# Altium schematic sheet 0141_FRONT PANEL - PWR .SchDoc
size 848 x 558 mm
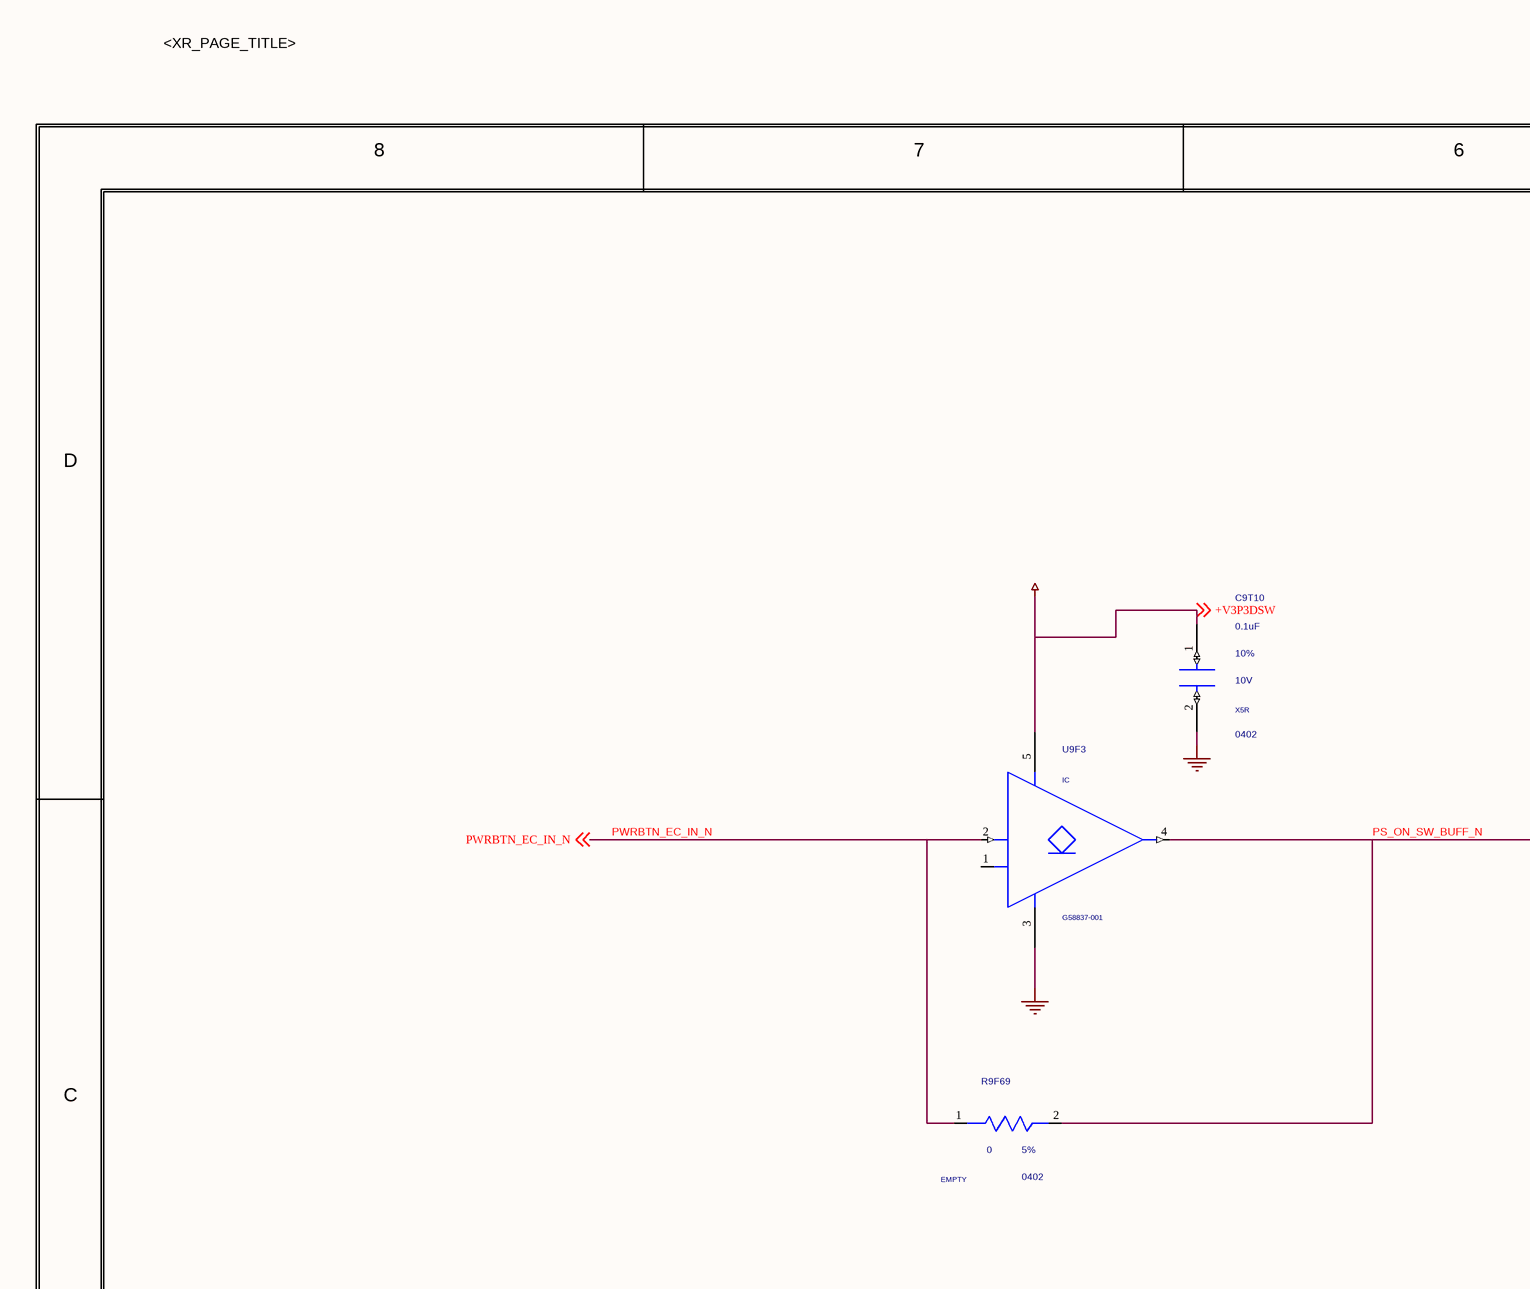
[diagram p0: 0141_FRONT PANEL - PWR .SchDoc, top left]
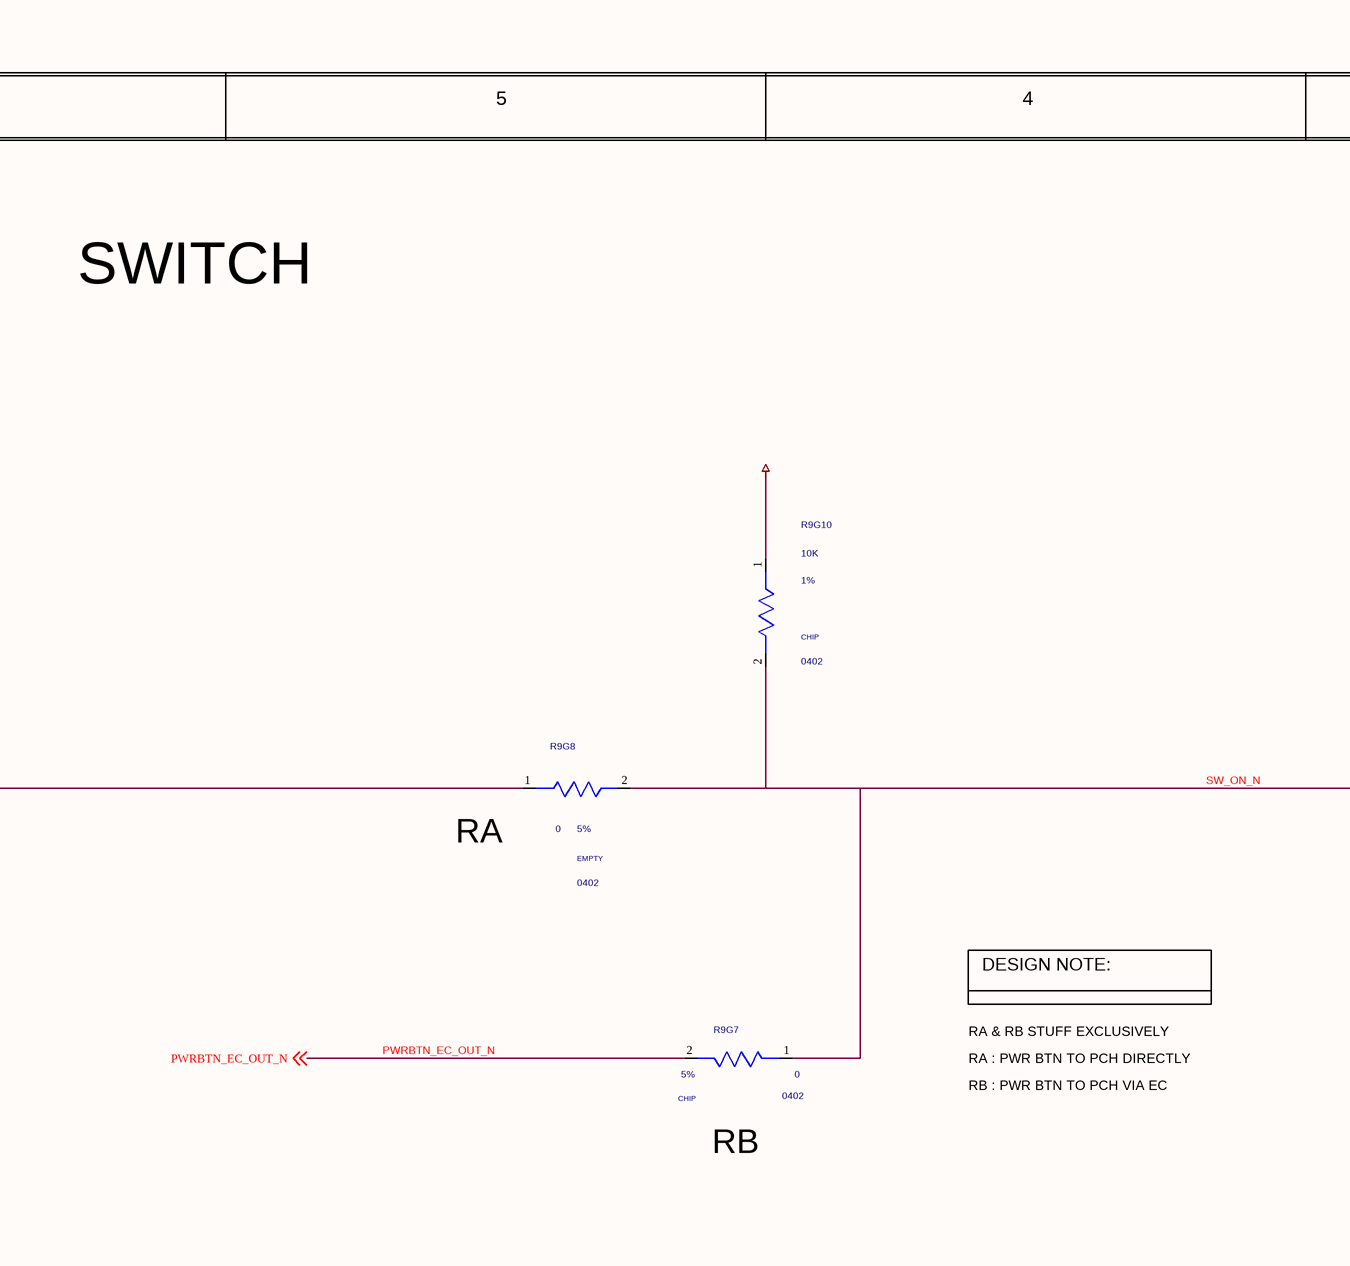
[diagram p1: 0141_FRONT PANEL - PWR .SchDoc, top middle]
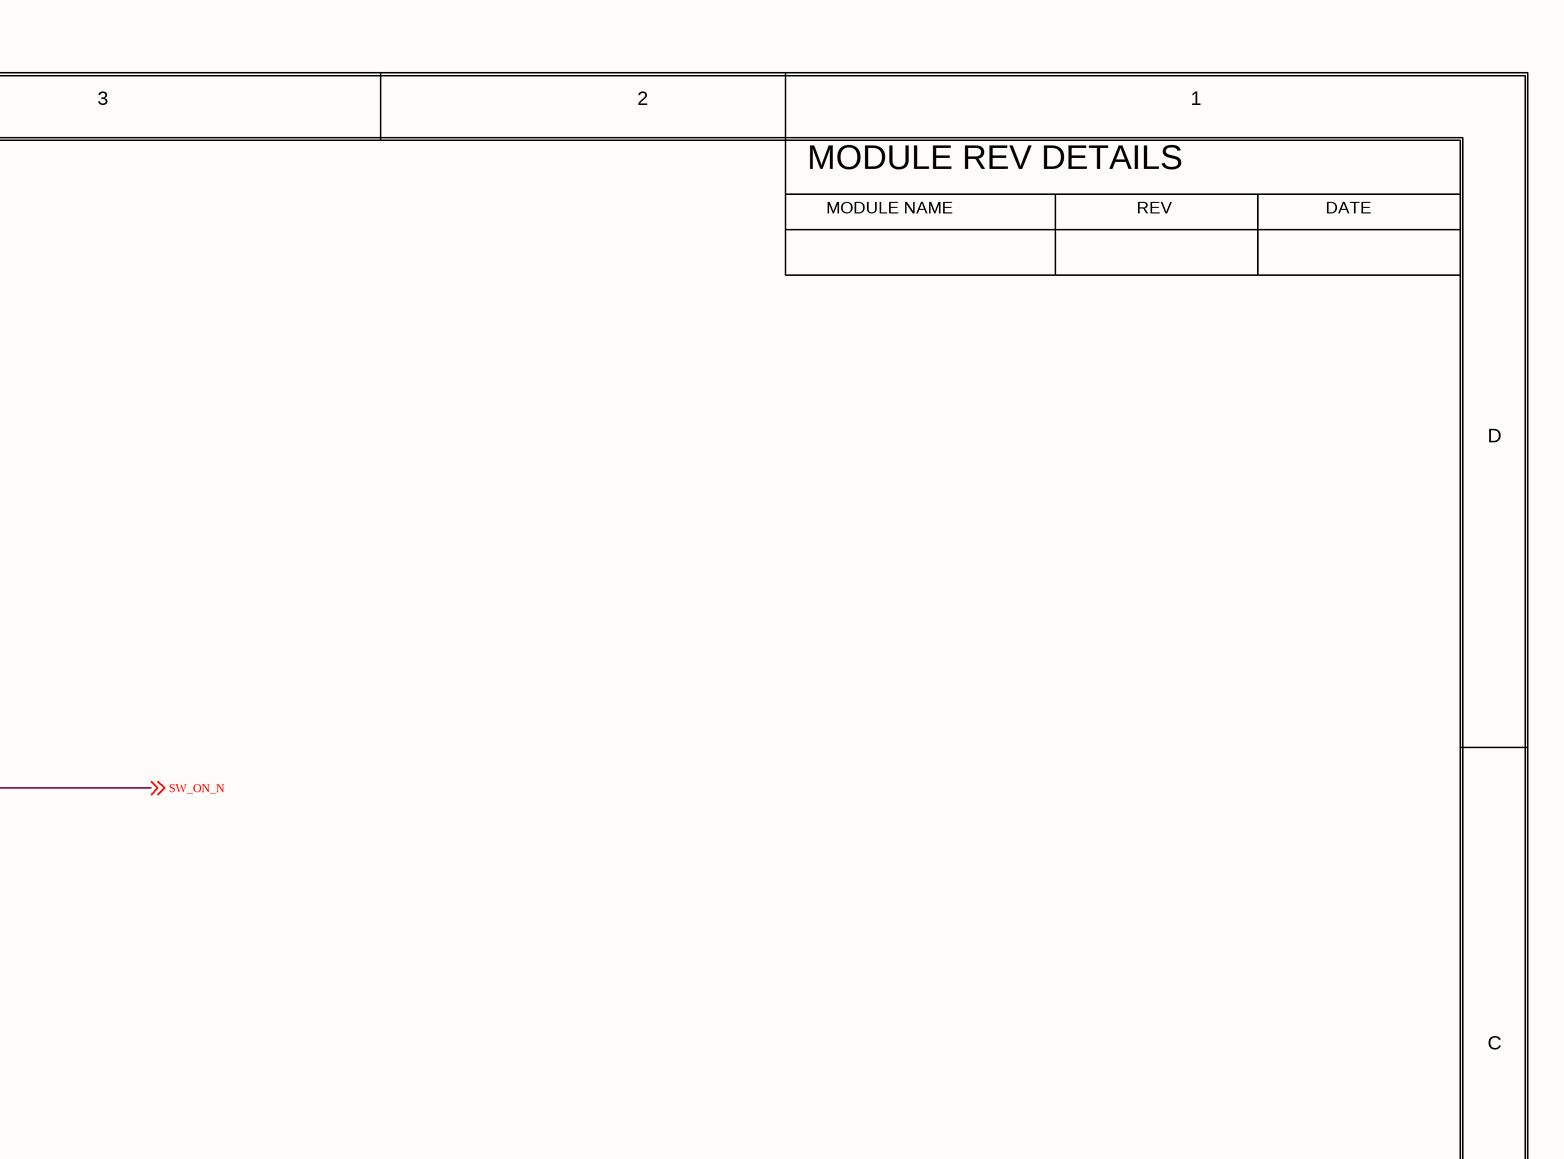
[diagram p2: 0141_FRONT PANEL - PWR .SchDoc, top right]
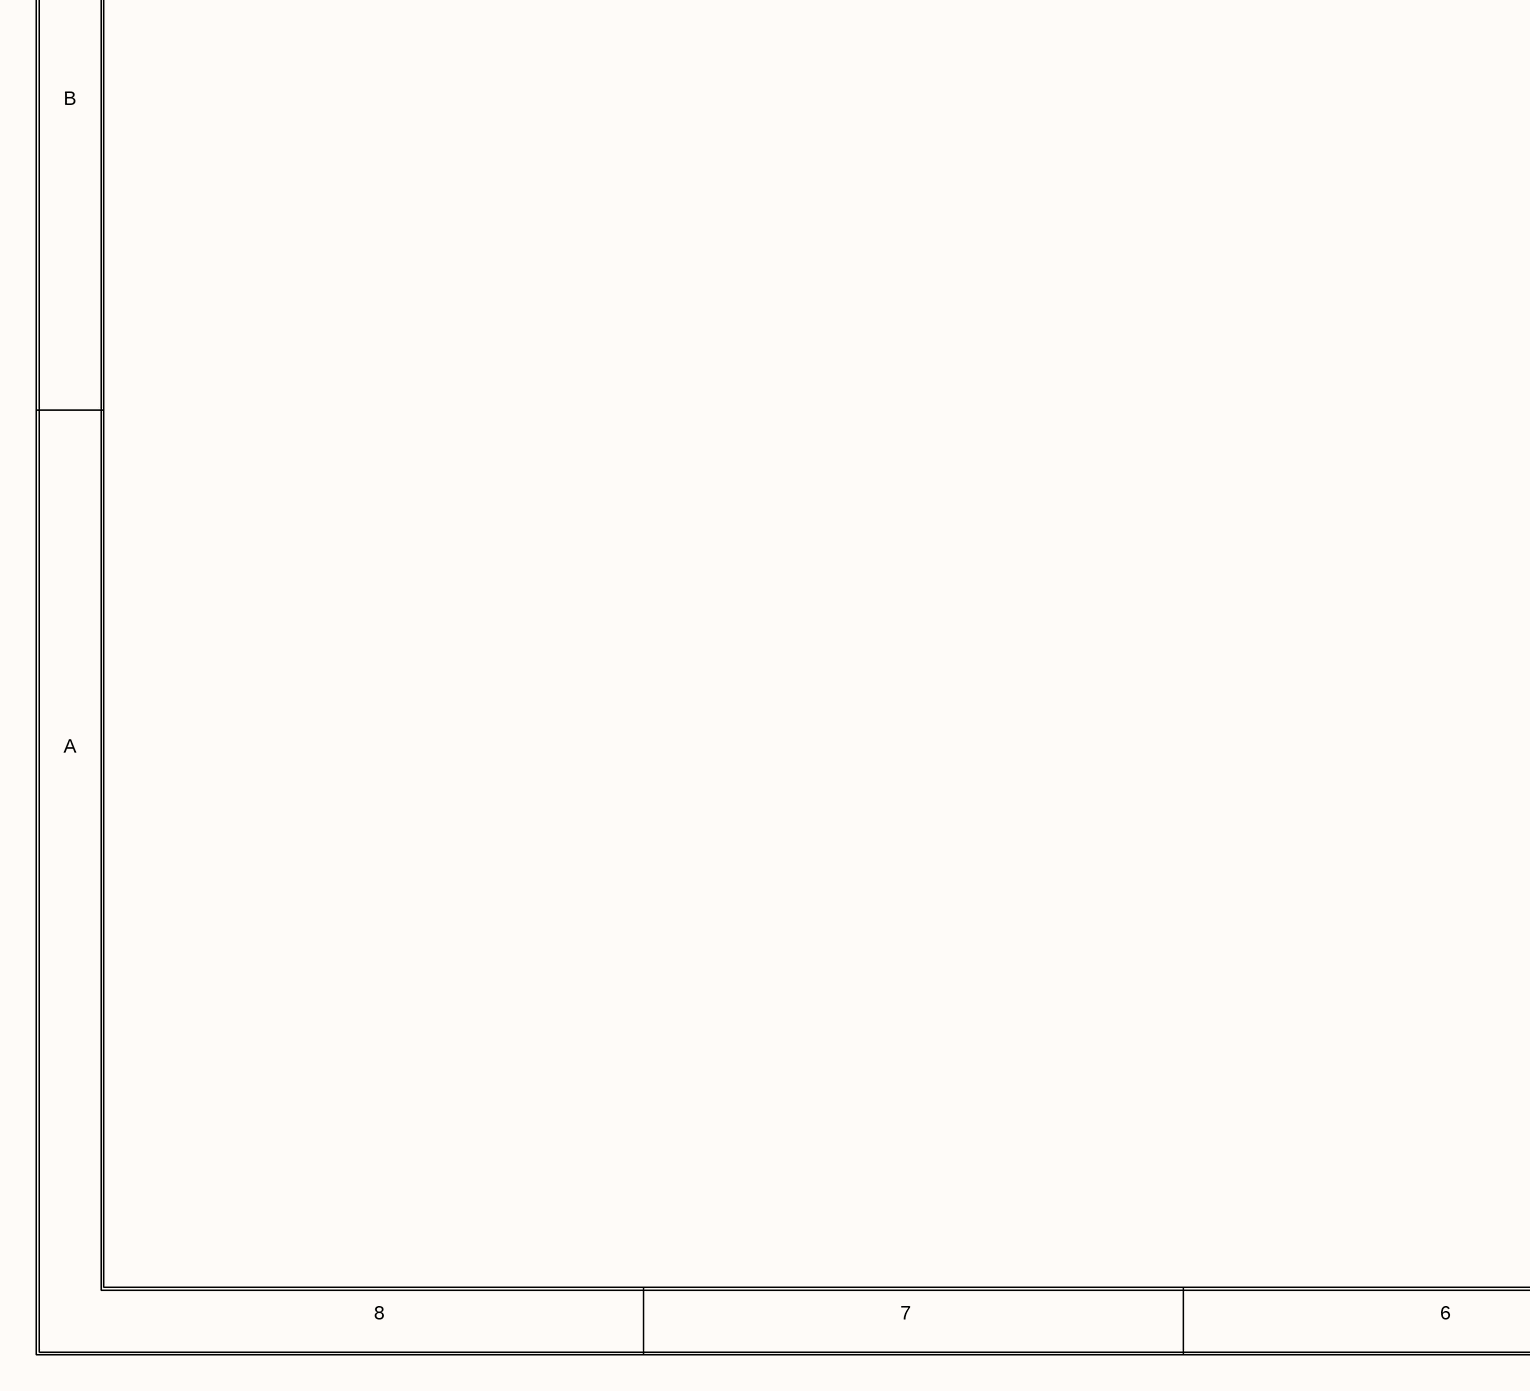
[diagram p3: 0141_FRONT PANEL - PWR .SchDoc, bottom left]
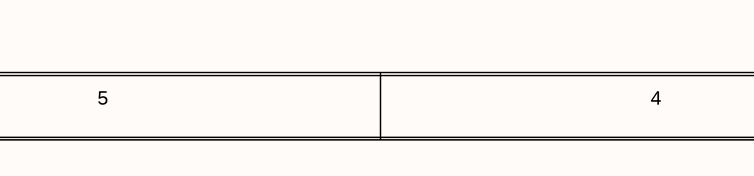
[diagram p4: 0141_FRONT PANEL - PWR .SchDoc, bottom middle]
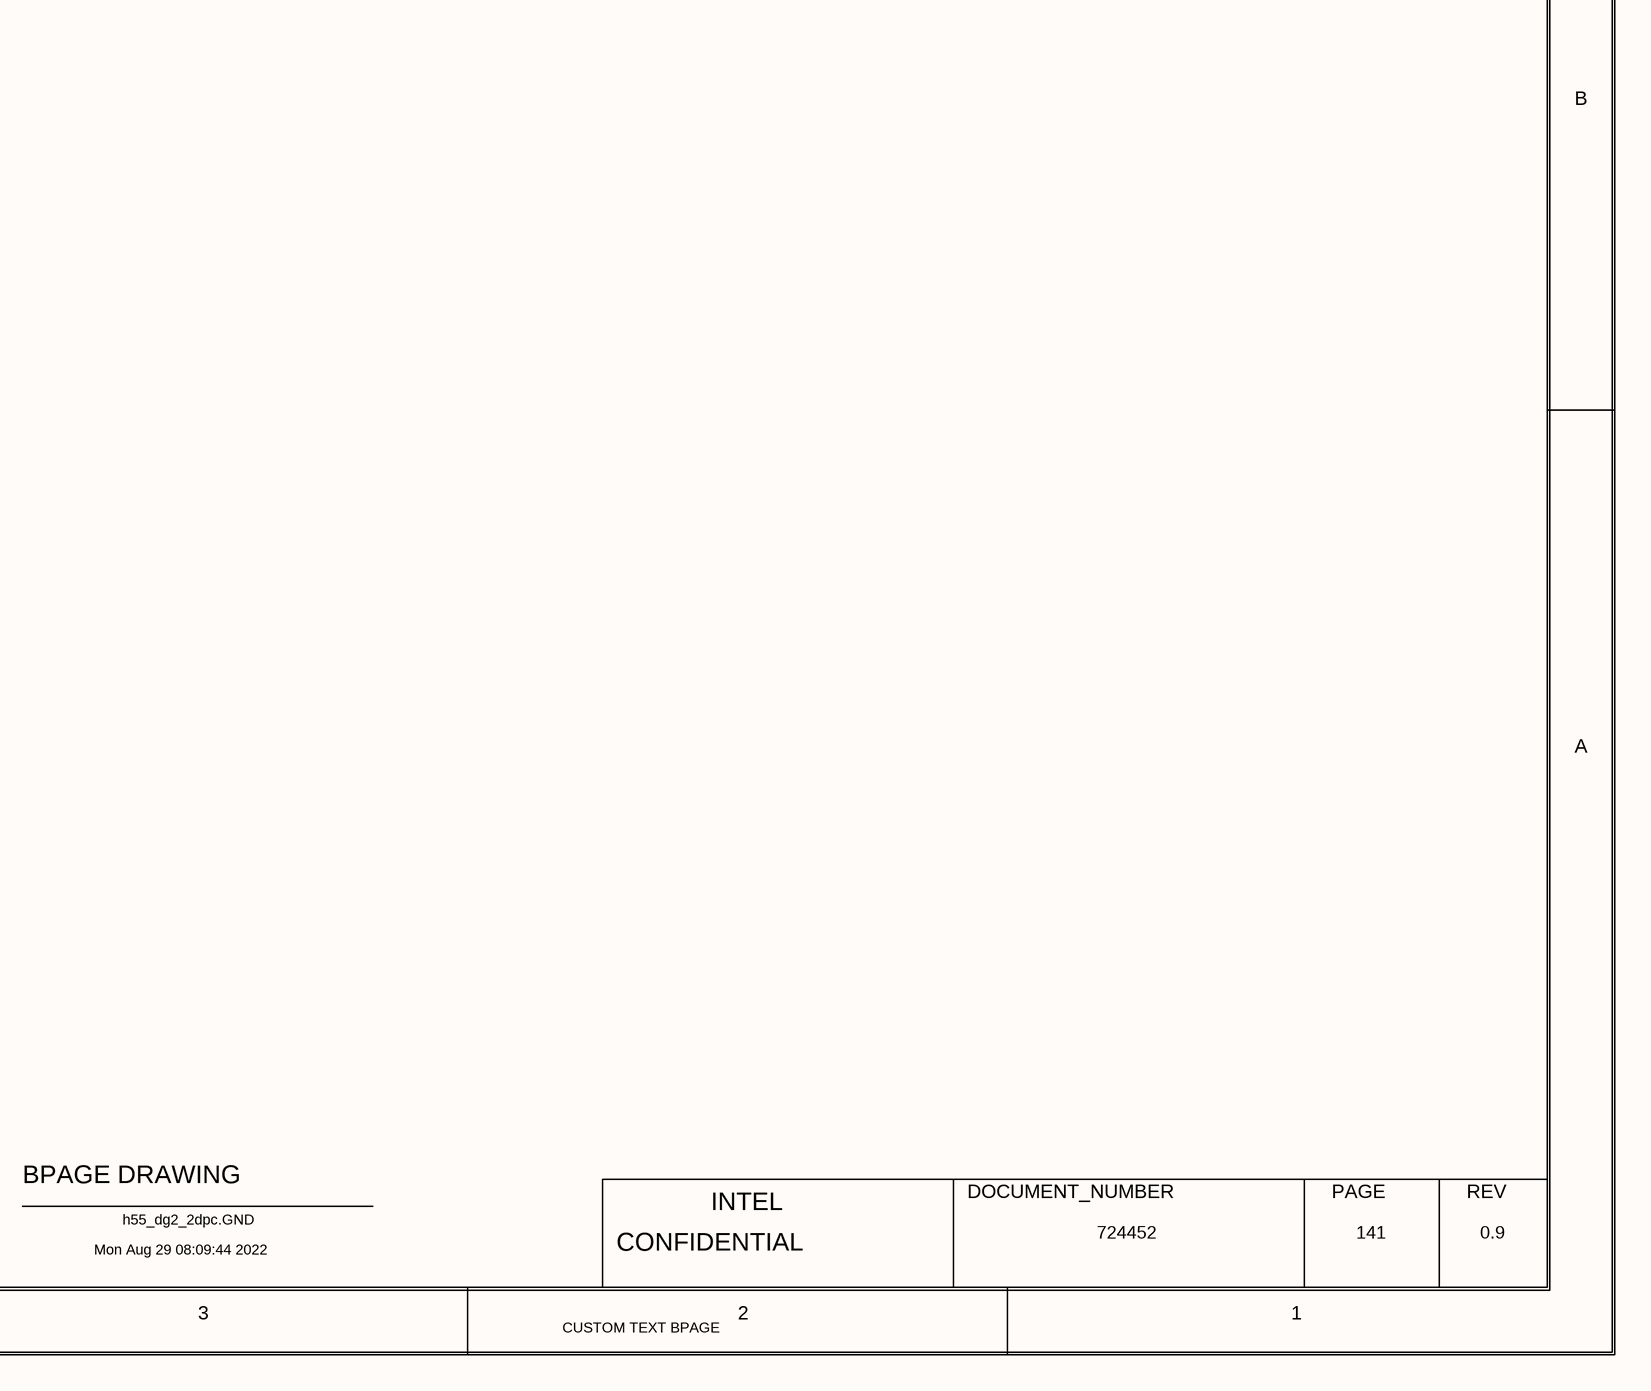
[diagram p5: 0141_FRONT PANEL - PWR .SchDoc, bottom right]

## Parts
C9T10  0.1uF  MATERIAL: X5R  PACK_TYPE: 0402  TOLERANCE: 10%  VOLTAGE: 10V  [SMC0402IA]
R9F69  0  MATERIAL: EMPTY  PACK_TYPE: 0402  TOLERANCE: 5%  [SMR0402IA]
R9G7  0  MATERIAL: CHIP  PACK_TYPE: 0402  TOLERANCE: 5%  [SMR0402IA]
R9G8  0  MATERIAL: EMPTY  PACK_TYPE: 0402  TOLERANCE: 5%  [SMR0402IA]
R9G10  10K  MATERIAL: CHIP  PACK_TYPE: 0402  TOLERANCE: 1%  [SMR0402IA]
U9F3  MATERIAL: IC  PART_NUMBER: G58837-001  [TSSOP5_21X13_65MA]  (hidden comment: TTL07)

## Nets
+V3P3DSW: C9T10.1(A) R9G10.1(A) U9F3.5(VCC) ; off-sheet +V3P3DSW
GND: C9T10.2(B) U9F3.3(GND)
PS_ON_SW_BUFF_N: R9F69.2(B) R9G8.1(A) U9F3.4(Y)
PWRBTN_EC_IN_N: R9F69.1(A) U9F3.2(A) ; off-sheet PWRBTN_EC_IN_N
PWRBTN_EC_OUT_N: R9G7.2(B) ; off-sheet PWRBTN_EC_OUT_N
SW_ON_N: R9G7.1(A) R9G8.2(B) R9G10.2(B) ; off-sheet SW_ON_N

Not connected (* = marked no-connect by the designer): U9F3 1(NC)

## Notes on the sheet
- <XR_PAGE_TITLE>
- 8
- 7
- 6
- 5
- 4
- 3
- 2
- 1
- MODULE REV DETAILS
- MODULE NAME
- REV
- DATE
- SWITCH
- D
- (near R9G8) RA
- DESIGN NOTE:
- C
- RA : PWR BTN TO PCH DIRECTLY
- RA & RB STUFF EXCLUSIVELY
- RB : PWR BTN TO PCH VIA EC
- RB
- B
- A
- BPAGE DRAWING
- INTEL
- DOCUMENT_NUMBER
- PAGE
- Mon Aug 29 08:09:44 2022
- h55_dg2_2dpc.GND
- CONFIDENTIAL
- 724452
- 141
- 0.9
- CUSTOM TEXT BPAGE

## Library data of the parts
C9T10 = CAP: PART_NUMBER: A36096-043; CDS_PHYS_PART_NAME: CAP_0402-A36096-043,X5R,0.1UF,10V,10%,LPDB,GENERIC; OriginalSymbolOrigin: (-50,25); XY: (-5975,4100); VER: 1; ROT: 0; ROOM: ROOM_PROP_TEST_259; PHYS_PAGE: 141; LOCATION: C9T10; IP: GENERIC; FP_TECH: LPDB; DRAWING: @RVP1_ADL_SB_ADP_S_DDR5_SODIMM_2DPC_LIB.H55_DG2_2DPC(SCH_1):PAGE510; CDS_LIB: discrete; PCB Footprint: SMC0402IA; CHIPS_PART_NAME: CAP; CDS_PART_NAME: CAP_0402-A36096-043,X5R,0.1UF,10V,10%,LPDB,GENERIC; CDS_LOCATION: C9T10
R9F69 = RES#1: PART_NUMBER: A93549-001; CHIPS_PART_NAME: RES; CDS_PHYS_PART_NAME: RES_0402-A93549-001,EMPTY,0,5%,1/16W,LPDB,GENERIC; WATTAGE: 1/16W; OriginalSymbolOrigin: (-75,25); XY: (-6325,3275); VER: 1; PHYS_PAGE: 141; LOCATION: R9F69; DRAWING: @RVP1_ADL_SB_ADP_S_DDR5_SODIMM_2DPC_LIB.H55_DG2_2DPC(SCH_1):PAGE510; CDS_LIB: discrete; PCB Footprint: SMR0402IA; ROT: 0; CDS_PART_NAME: RES_0402-A93549-001,EMPTY,0,5%,1/16W,LPDB,GENERIC; CDS_LOCATION: R9F69
R9G7 = RES#1: PART_NUMBER: A93549-001; CHIPS_PART_NAME: RES; CDS_PHYS_PART_NAME: RES_0402-A93549-001,CHIP,0,5%,1/16W,LPDB,GENERIC; WATTAGE: 1/16W; OriginalSymbolOrigin: (-75,25); XY: (-4050,3300); VER: 1; ROT: 2; PHYS_PAGE: 141; LOCATION: R9G7; IP: GENERIC; FP_TECH: LPDB; FIN: EC; DRAWING: @RVP1_ADL_SB_ADP_S_DDR5_SODIMM_2DPC_LIB.H55_DG2_2DPC(SCH_1):PAGE510; CDS_LIB: discrete; PCB Footprint: SMR0402IA; CDS_PART_NAME: RES_0402-A93549-001,CHIP,0,5%,1/16W,LPDB,GENERIC; CDS_LOCATION: R9G7; ASI_MODEL: A93549-001
R9G8 = RES#1: PART_NUMBER: A93549-001; CHIPS_PART_NAME: RES; CDS_PHYS_PART_NAME: RES_0402-A93549-001,EMPTY,0,5%,1/16W,LPDB,GENERIC; WATTAGE: 1/16W; OriginalSymbolOrigin: (-75,25); XY: (-4350,3800); VER: 1; PHYS_PAGE: 141; LOCATION: R9G8; IP: GENERIC; FP_TECH: LPDB; FIN: FP; DRAWING: @RVP1_ADL_SB_ADP_S_DDR5_SODIMM_2DPC_LIB.H55_DG2_2DPC(SCH_1):PAGE510; CDS_LIB: discrete; BOM: FP_HEADER; PCB Footprint: SMR0402IA; ROT: 0; CDS_PART_NAME: RES_0402-A93549-001,EMPTY,0,5%,1/16W,LPDB,GENERIC; CDS_LOCATION: R9G8; ASI_MODEL: A93549-001
R9G10 = RES: PART_NUMBER: A93548-034; CDS_PHYS_PART_NAME: RES_0402-A93548-034,CHIP,10K,1%,1/16W,LPDB,GENERIC; WATTAGE: 1/16W; OriginalSymbolOrigin: (-25,75); XY: (-4000,4125); VER: 2; ROT: 0; PHYS_PAGE: 141; LOCATION: R9G10; IP: GENERIC; FP_TECH: LPDB; DRAWING: @RVP1_ADL_SB_ADP_S_DDR5_SODIMM_2DPC_LIB.H55_DG2_2DPC(SCH_1):PAGE510; CDS_LIB: discrete; PCB Footprint: SMR0402IA; CHIPS_PART_NAME: RES; CDS_PART_NAME: RES_0402-A93548-034,CHIP,10K,1%,1/16W,LPDB,GENERIC; CDS_LOCATION: R9G10
U9F3 = TTL07: CDS_PHYS_PART_NAME: TTL07_SM-G58837-001,IC,74AUP1G07GW,LPDB,GENERIC; CDS_LMAN_SYM_OUTLINE: -100,150,150,-150; PACK_TYPE: SM; OriginalSymbolOrigin: (-125,125); XY: (-6225,3800); VER: 1; ROT: 0; PHYS_PAGE: 141; LOCATION: U9F3; IP: GENERIC; FP_TECH: LPDB; DRAWING: @RVP1_ADL_SB_ADP_S_DDR5_SODIMM_2DPC_LIB.H55_DG2_2DPC(SCH_1):PAGE510; CDS_LIB: ttl; PCB Footprint: TSSOP5_21X13_65MA; CHIPS_PART_NAME: TTL07; CDS_PART_NAME: TTL07_SM-G58837-001,IC,74AUP1G07GW,LPDB,GENERIC; CDS_LOCATION: U9F3